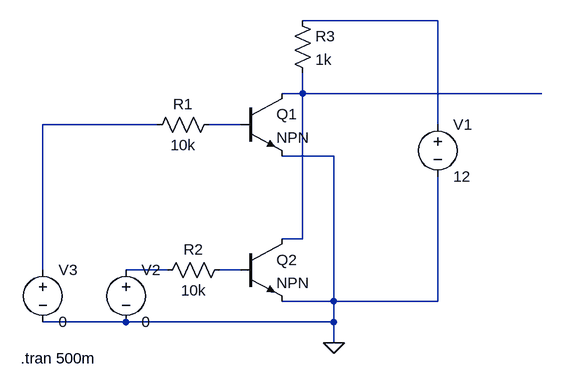
[diagram p0: schematic nor_transistor.asc]
nor_transistor.asc, the LTspice schematic file:
Version 4
SHEET 1 880 680
WIRE 416 -16 208 -16
WIRE 208 96 208 64
WIRE 208 96 176 96
WIRE 576 96 208 96
WIRE -16 144 -192 144
WIRE 112 144 64 144
WIRE 416 144 416 -16
WIRE 256 192 176 192
WIRE 208 320 208 96
WIRE 208 320 176 320
WIRE -192 368 -192 144
WIRE 0 368 -64 368
WIRE 112 368 80 368
WIRE 256 416 256 192
WIRE 256 416 176 416
WIRE 416 416 416 224
WIRE 416 416 256 416
WIRE -64 448 -192 448
WIRE 256 448 256 416
WIRE 256 448 -64 448
WIRE 256 480 256 448
FLAG 256 480 0
SYMBOL npn 112 96 R0
SYMATTR InstName Q1
SYMBOL npn 112 320 R0
SYMATTR InstName Q2
SYMBOL res 80 128 R90
WINDOW 0 0 56 VBottom 2
WINDOW 3 32 56 VTop 2
SYMATTR InstName R1
SYMATTR Value 10k
SYMBOL res 96 352 R90
WINDOW 0 0 56 VBottom 2
WINDOW 3 32 56 VTop 2
SYMATTR InstName R2
SYMATTR Value 10k
SYMBOL res 192 -32 R0
SYMATTR InstName R3
SYMATTR Value 1k
SYMBOL voltage 416 128 R0
WINDOW 123 0 0 Left 0
WINDOW 39 0 0 Left 0
SYMATTR InstName V1
SYMATTR Value 12
SYMBOL voltage -64 352 R0
WINDOW 123 0 0 Left 0
WINDOW 39 0 0 Left 0
SYMATTR InstName V2
SYMATTR Value 0
SYMBOL voltage -192 352 R0
WINDOW 123 0 0 Left 0
WINDOW 39 0 0 Left 0
SYMATTR InstName V3
SYMATTR Value 0
TEXT -226 504 Left 2 !.tran 500m

The netlist it stands for:
* nor_transistor.asc
Q1 N002 N004 0 0 NPN
Q2 N002 N006 0 0 NPN
R1 N004 N003 10k
R2 N006 N005 10k
R3 N001 N002 1k
V1 N001 0 12
V2 N005 0 0
V3 N003 0 0
.model NPN NPN
.model PNP PNP
.lib standard.bjt
.tran 500m
.backanno
.end